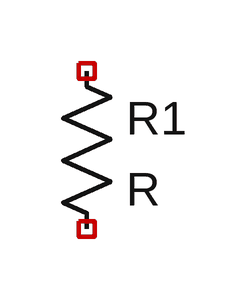
[diagram p0: schematic Parameter_Sweeps_RC_Response.asc]
Parameter_Sweeps_RC_Response.asc, the LTspice schematic file:
Version 4
SHEET 1 880 680
SYMBOL res 144 128 R0
SYMATTR InstName R1

The netlist it stands for:
* Parameter_Sweeps_RC_Response.asc
R1 NC_01 NC_02 R
.backanno
.end